# Altium schematic sheet USB.SchDoc: USB Connection
size A4; DrawnBy: M. Small & J. Wilson; SheetNumber: 10; SheetTotal: 10
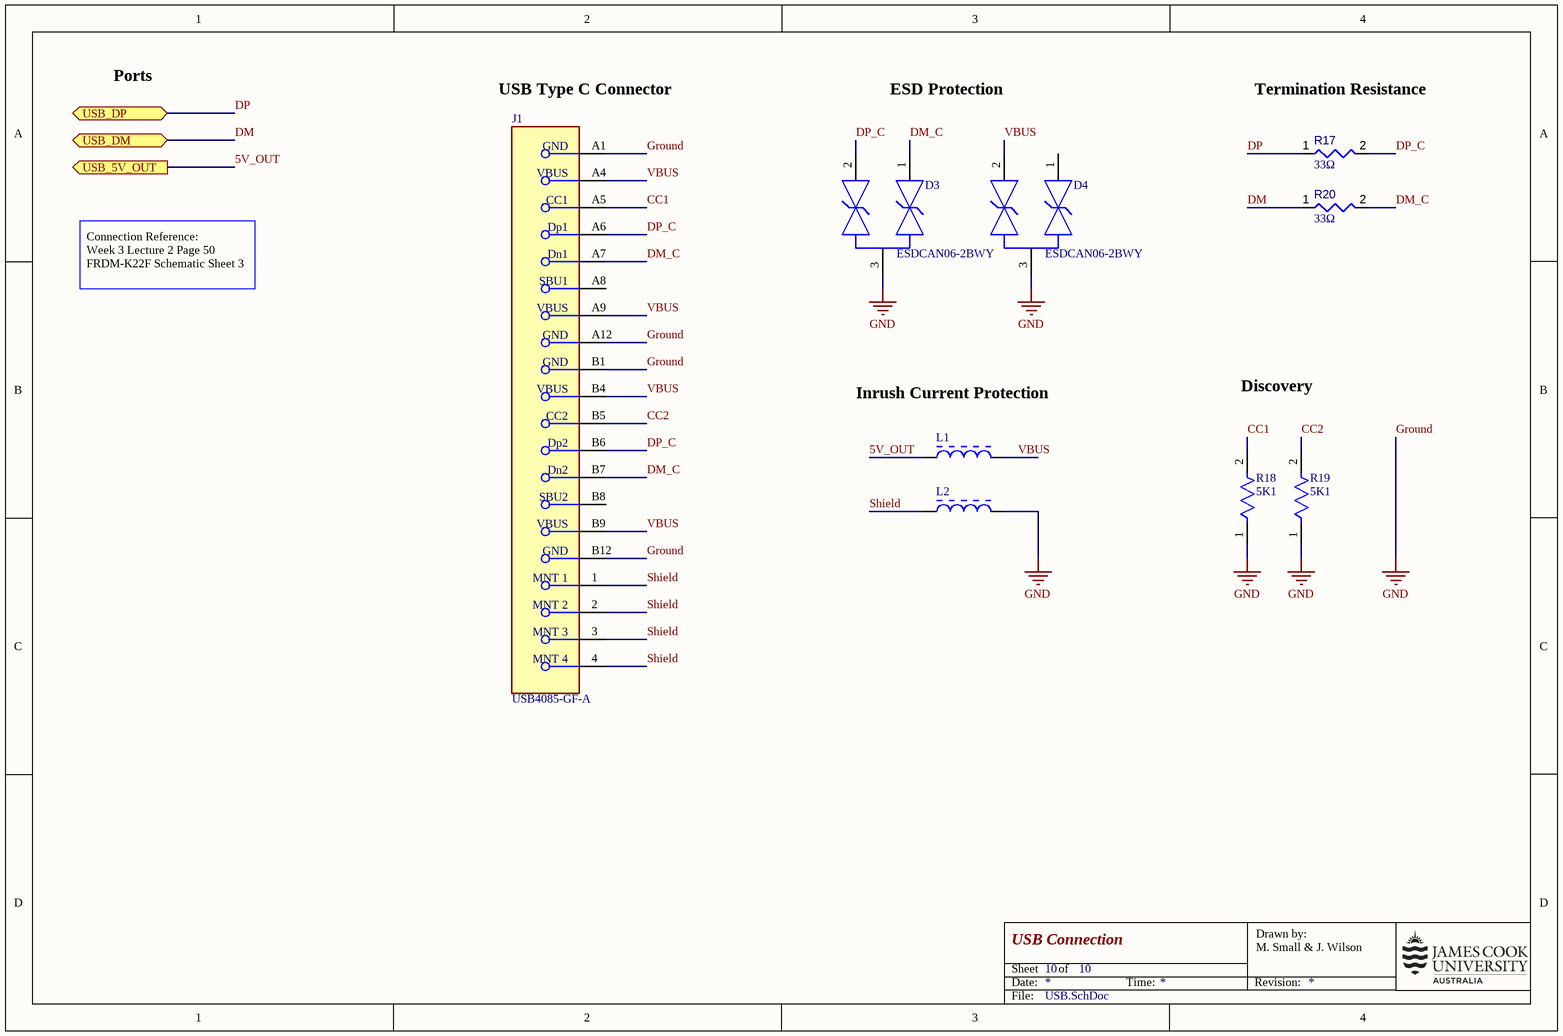
[diagram p0: USB.SchDoc]

## Parts
D3  ESDCAN06-2BWY  [FP-SOT323-3L-MFG]
D4  ESDCAN06-2BWY  [FP-SOT323-3L-MFG]
J1  USB4085-GF-A  [FP-USB4085-GF-A-MFG]
L1  Z0805C331BPWZT  [INDC2013X105X50ML20T20]  (value not drawn)
L2  Z0805C331BPWZT  [INDC2013X105X50ML20T20]  (value not drawn)
R17  value 33Ω  [RESC0805(2012)_L]
R18  5K1  [FP-CRCW0805-e3-MFG]
R19  5K1  [FP-CRCW0805-e3-MFG]
R20  value 33Ω  [RESC0805(2012)_L]

## Ports
USB_5V_OUT (out), USB_DM (bidir), USB_DP (bidir)

## Nets
Ground: D3.3 D4.3 J1.A1(GND) J1.A12(GND) J1.B1(GND) J1.B12(GND) L2.2 R18.1 R19.1  [also labelled GND]
5V_OUT: L1.1 ; port USB_5V_OUT
CC1: J1.A5(CC1) R18.2
CC2: J1.B5(CC2) R19.2
DM: R20.1 ; port USB_DM
DM_C: D3.1 J1.A7(Dn1) J1.B7(Dn2) R20.2
DP: R17.1 ; port USB_DP
DP_C: D3.2 J1.A6(Dp1) J1.B6(Dp2) R17.2
Shield: J1.1(MNT_1) J1.2(MNT_2) J1.3(MNT_3) J1.4(MNT_4) L2.1
VBUS: D4.2 J1.A4(VBUS) J1.A9(VBUS) J1.B4(VBUS) J1.B9(VBUS) L1.2

Not connected (* = marked no-connect by the designer): D4 1; J1 A8(SBU1) B8(SBU2)

## Notes on the sheet
- Ports
- USB Type C Connector
- ESD Protection
- Termination Resistance
- Connection Reference:
  Week 3 Lecture 2 Page 50
  FRDM-K22F Schematic Sheet 3
- Inrush Current Protection
- Discovery
- Date:
- Sheet
- of
- Time:
- Revision:
- Drawn by:
- File:

## Library data of the parts
D3 D4 = CMP-12225-000055-1: TVS DIODE 35V 59V SOT323-3; Manufacturer: STMicroelectronics; Manufacturer Part Number: ESDCAN02-2BWY; Value: 15pF; Direction: Bidirectional; Breakdown Voltage: 38V; Automotive Grade: Grade 0; Standoff Height: 0mm; Peak Pulse Power: 170W; Peak Pulse Current: 3A; Capacitance: 3pF; Number Of Channels: 2; Max Junction Temp: +175°C; Mouser Description: TVS Diodes / ESD Suppressors Automotive dual-line Transil, Transient voltage suppressor (TVS) for CAN bus; Height: 1.1mm; Category: Diode; Reverse Standoff Voltage: 35V; Device Class L1: Circuit Protection; Temperature: -55°C to +175°C; RoHS: TRUE; ComponentLink2URL: https://www.st.com/resource/en/datasheet/esdcan02-2bwy.pdf; Device Class L3: unset; Device Class L2: TVS Diodes; Temperature Range High: +175°C; Octopart: https://octopart.com/esdcan02-2bwy-stmicroelectronics-58631133; Ipc Land Pattern Name: SOT65P210X95-3; Temperature Range Low: -55°C; Digikey Description: TVS DIODE 26.5V 44V SOT323-3; Automotive: Yes; ComponentLink2Description: Datasheet; Clamping Voltage: 59V; Lead Free: Yes; Package: SOT323-3L; Datasheet: https://au.mouser.com/datasheet/2/389/dm00551472-1799515.pdf
J1 = CMP-196119-000001-1: CONN RCPT USB2.0 TYPEC 16POS; Manufacturer: Global Connector Technology; Voltage Rating: 20V; Conn Orientation: Right Angle; Shielding: true; Current Rating: 4.25A; Number Of Contacts: 16; Pitch: 0.85mm; Is Female: yes; ComponentLink2URL: https://gct.co/files/drawings/usb4085.pdf; Category: Conn; Automotive: No; ComponentLink2Description: Datasheet; Height: 3.66mm; Manufacturer Part Number: USB4085-GF-A; Package: 0; Usb Standard: USB 2.0; Octopart: https://octopart.com/usb4085-gf-a-global+connector+technology-94773699; Device Class L3: unset; Digikey Description: CONN RCPT USB2.0 TYPEC 16POS; Temperature Range Low: -40°C; Temperature: -40°C to +85°C; Lead Free: Yes; Contact Material: Gold,Nickel; Device Class L1: Connectors; Temperature Range High: +85°C; Device Class L2: USB Connectors; RoHS: TRUE
L1 L2 = CMP-006-00000-2: IND, Chip Ferrite Bead, 330 Ohm, +/- 25%, 1.8 A, -40 to 125 degC, 0805 (2012 Metric), Tape and Reel; Manufacturer: KEMET; Max Current Rating: 1.8A; Resistance: 90mohm; Impedance: 330Ohm; Package Reference: 0805; Tolerance: 25%; Current Rating: 1.8A; Mounting Technology: SM; Min Operating Temperature: -40°C; Max Operating Temperature: 125°C; Core Material: Ferrite; Package Description: 2-Pin Surface Mount Device, Body 2 x1.25 mm; RoHS Compliant: True; Packaging: TapeandReel; Package Quantity: 4000; Datasheet Version: Nov-11; Datasheet URL: https://au.mouser.com/datasheet/2/212/1/KEM_FB0002_Z_PWZ-2064396.pdf; Case/Package: 0805
R17 R20 = CMP-009-00106-1: 33R 0.125W 5% 0805 (2012 Metric)  SMD; Tolerance: 5%; Power: 0.125W; Mounting Technology: SMT; Case/Package: 0805; Pins: 2
R18 R19 = CMP-2001-03823-2: RES Thick Film, 5K1Ω, 1%, 0.125W, 100ppm/°C, 0805; Voltage Rating (DC): 150V; Max Power Dissipation: 125mW; Mount: Surface Mount; Packaging: Tape and Reel; Min Operating Temperature: -55°C; Resistance: 5K1; Military Standard: Not; Case Code (Metric): 2012; Height: 0.02inch; Voltage Rating: 150V; Case/Package: 0805; Max Operating Temperature: 155°C; Width: 0.049inch; Case Code (Imperial): 0805; Termination: SMD/SMT; Lead Free: Lead Free; Contact Plating: Tin; Package Quantity: 10; Composition: Thick Film; Length: 2mm; Features: Automotive AEC-Q200; Depth: 1.25mm; Weight: 0.000194oz; Tolerance: 1%; Power Rating: 125mW; Number of Terminations: 2; Temperature Coefficient: 100ppm/°C